# EAGLE schematic TerminalBlock (EAGLE 9.6.2)
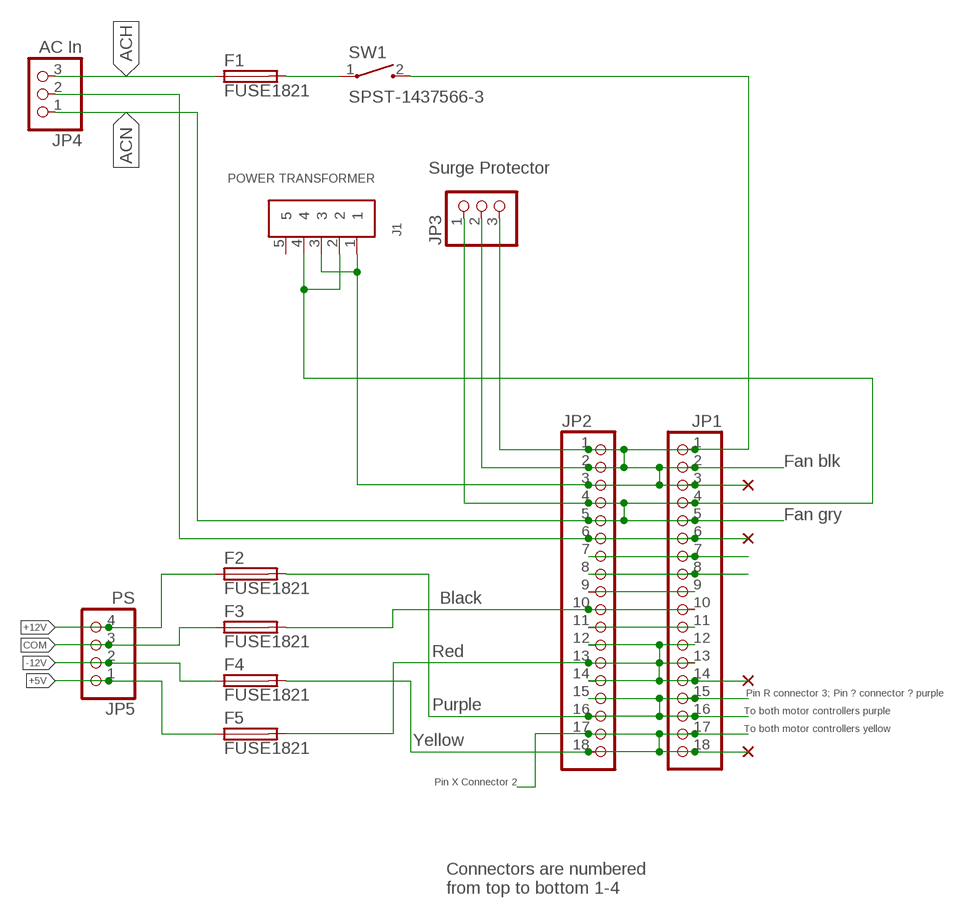
[diagram p0: schematic, sheet 1]

## Parts
F1  FUSE1821  [FUSE_HOLDER_MENTOR-1821]
F2  FUSE1821  [FUSE_HOLDER_MENTOR-1821]
F3  FUSE1821  [FUSE_HOLDER_MENTOR-1821]
F4  FUSE1821  [FUSE_HOLDER_MENTOR-1821]
F5  FUSE1821  [FUSE_HOLDER_MENTOR-1821]
J1  POWER TRANSFORMER  PINHD-1X5-ESQ-105-33-T-S  [1X05-ESQ-105-33-T-S]
JP1  PINHD-1X18-BIG  [1X18-BIG]
JP2  PINHD-1X18-BIG  [1X18-BIG]
JP3  Surge Protector  PINHD-1X3  [1X03]
JP4  AC In  PINHD-1X3  [1X03]
JP5  PS  PINHD-1X4  [1X04]
SW1  SPST-1437566-3  [SW_1437566-3]

## Nets
+5V: F5.A JP5.1
+12V: F2.A JP5.4
-12V: F4.A JP5.2
ACH: F1.A J1.1 J1.3 JP1.1 JP1.2 JP1.3 JP2.1 JP2.2 JP2.3 JP3.2 JP3.3 JP4.3 SW1.2
ACN: J1.2 J1.4 JP1.4 JP1.5 JP2.4 JP2.5 JP3.1 JP4.1
COM: F3.A JP5.3
EARTH: JP1.6 JP2.6 JP4.2
N$1: F1.B SW1.1
N$3: JP1.7 JP2.7
N$4: JP1.8 JP2.8
N$5: JP1.9 JP2.9
N$6: F3.B JP1.10 JP2.10
N$7: JP1.11 JP2.11
N$8: F5.B JP1.12 JP1.13 JP1.14 JP2.12 JP2.13 JP2.14
N$11: F2.B JP1.15 JP1.16 JP2.15 JP2.16
N$14: F4.B JP1.17 JP1.18 JP2.17 JP2.18
Unconnected: J1.5

## Notes on the sheet
- Fan blk
- Fan gry
- Black
- Red
- Pin R connector 3; Pin ? connector ? purple
- Purple
- To both motor controllers purple
- To both motor controllers yellow
- Yellow
- Pin X Connector 2
- Connectors are numbered
  from top to bottom 1-4

## Library data of the parts
F1-F5 = fuse:FUSE: Fuse; OC_FARNELL: unknown; OC_NEWARK: unknown
J1 = AUmlib:PINHD-1X5-ESQ-105-33-T-S
JP1 JP2 = adafruit:PINHD-1X18: PIN HEADER
JP3 JP4 = AUmlib:PINHD-1X3: PIN HEADER
JP5 = AUmlib:PINHD-1X4: PIN HEADER
SW1 = AUmlib:SPST-1437566-3: Switch Tactile OFF (ON) SPST Rectangular Button Gull Wing 0.05A 12VDC SMD Loose Piece; MANUFACTURER: TE CONNECTIVITY; PARTREV: C2; STANDARD: Manufacturer recommendations